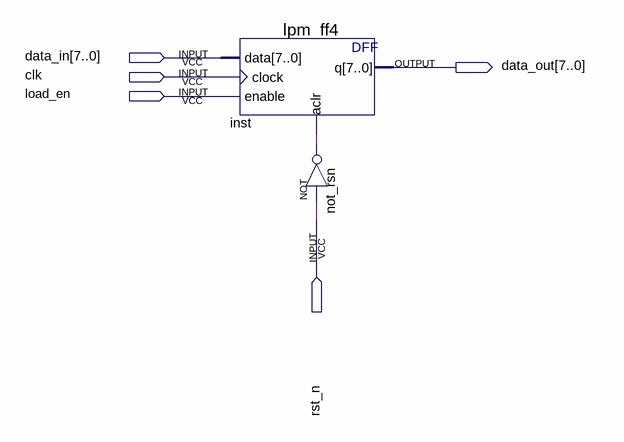
[diagram p0: schematic sheet]
// Quartus schematic dr_unit.bdf as structural Verilog: 2 symbols, 5 pins
module dr_unit (
  input  [7:0] data_in,
  input  clk,
  input  load_en,
  input  rst_n,
  output [7:0] data_out
);

  wire not_rsn_out;

  lpm_ff4 inst (.data(data_in), .clock(clk), .enable(load_en), .aclr(not_rsn_out), .q(data_out));
  not not_rsn (not_rsn_out, rst_n);
endmodule
